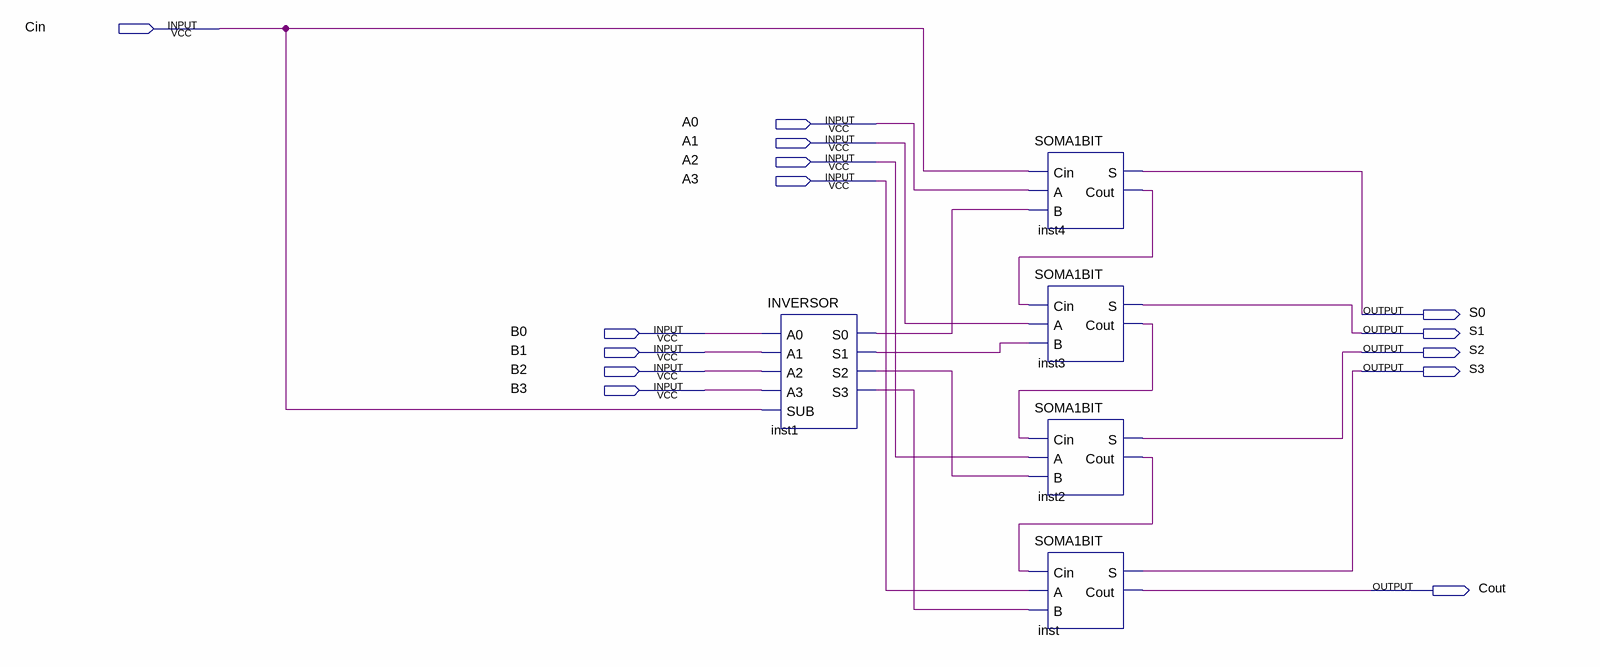
[diagram p0: schematic sheet]
// Quartus schematic SOMA4BITS.bdf as structural Verilog: 5 symbols, 14 pins
module SOMA4BITS (
  input  Cin,
  input  A0,
  input  A1,
  input  A2,
  input  A3,
  input  B0,
  input  B1,
  input  B2,
  input  B3,
  output S0,
  output S1,
  output S2,
  output S3,
  output Cout
);

  wire inst1_s0, inst1_s1, inst1_s2, inst1_s3, inst2_cout, inst3_cout, inst4_cout;

  INVERSOR inst1 (
    .A0(B0), .A1(B1), .A2(B2), .A3(B3), .SUB(Cin), .S0(inst1_s0), .S1(inst1_s1), .S2(inst1_s2), .S3(inst1_s3));
  SOMA1BIT inst4 (.Cin(Cin), .A(A0), .B(inst1_s0), .S(S0), .Cout(inst4_cout));
  SOMA1BIT inst3 (.Cin(inst4_cout), .A(A1), .B(inst1_s1), .S(S1), .Cout(inst3_cout));
  SOMA1BIT inst2 (.Cin(inst3_cout), .A(A2), .B(inst1_s2), .S(S2), .Cout(inst2_cout));
  SOMA1BIT inst (.Cin(inst2_cout), .A(A3), .B(inst1_s3), .S(S3), .Cout(Cout));
endmodule
